# Altium project AUTetris.PrjPcb
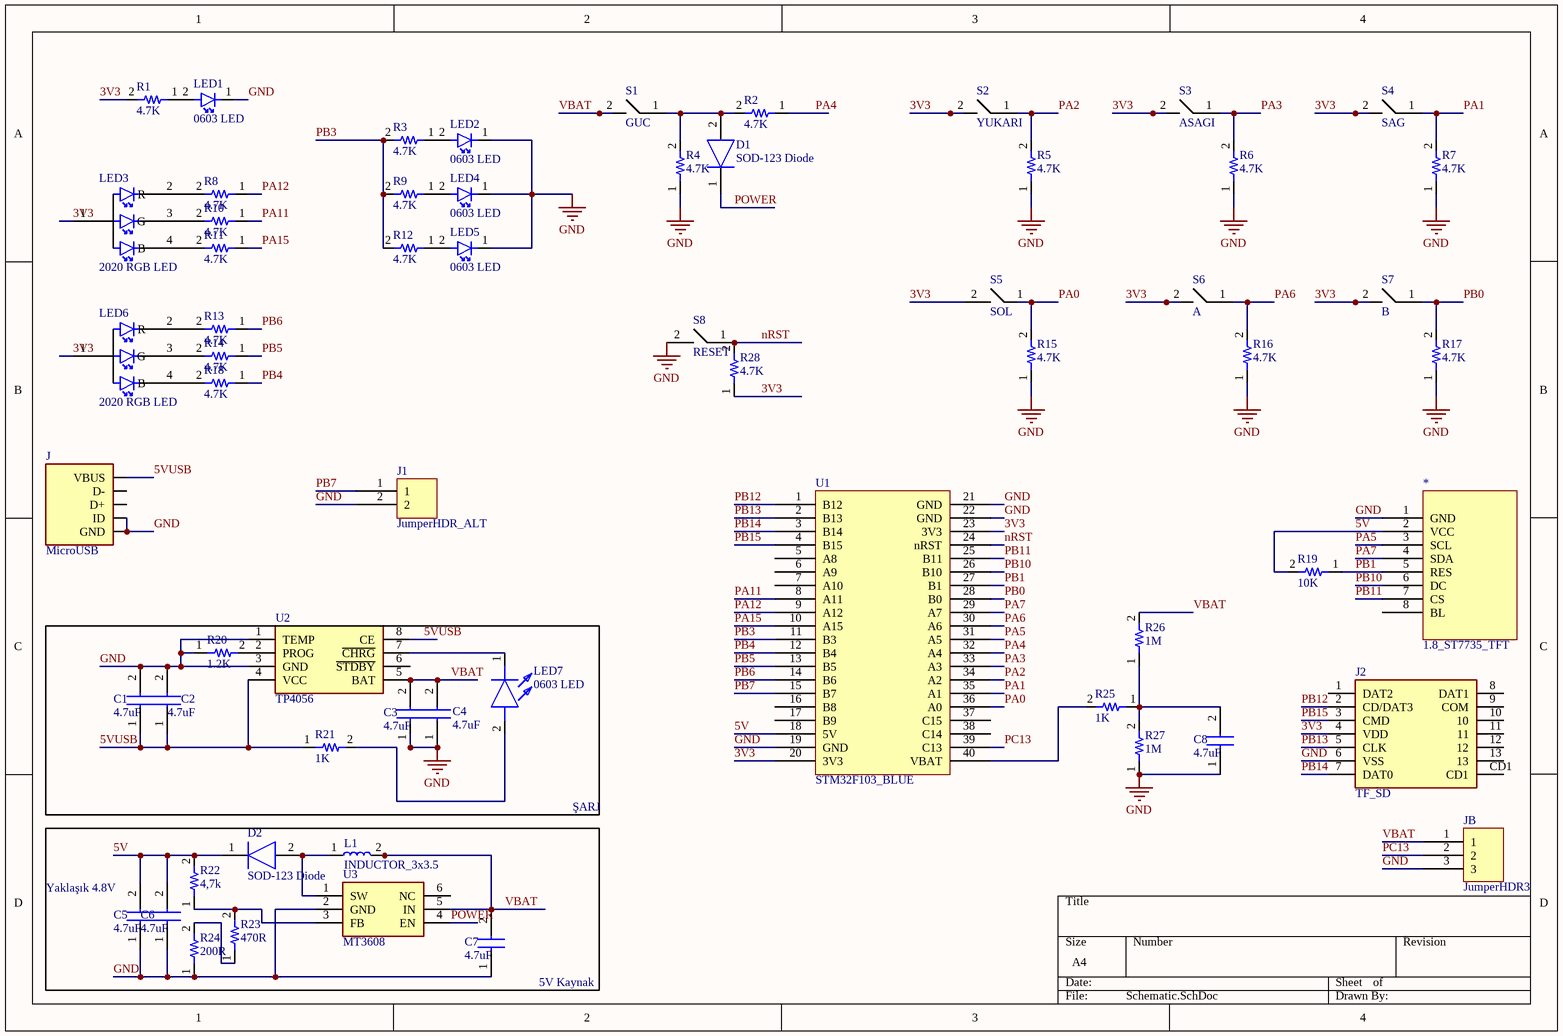
[diagram p0: Schematic.SchDoc]
1 sheet, 62 parts. Net scope: global (net labels, ports and power ports of the same name join across sheets).
Board file: PCB.PcbDoc

## Sheet Schematic.SchDoc
size A4; SheetNumber: 1; SheetTotal: 1

### Parts
*  1.8_ST7735_TFT  [1.8_ST7735_TFT]
C1  4.7uF  [0603 Capacitor]
C2  4.7uF  [0603 Capacitor]
C3  4.7uF  [0603 Capacitor]
C4  4.7uF  [0603 Capacitor]
C5  4.7uF  [0603 Capacitor]
C6  4.7uF  [0603 Capacitor]
C7  4.7uF  [0603 Capacitor]
C8  4.7uF  [0603 Capacitor]
D1  SOD-123 Diode  [SOD123]
D2  SOD-123 Diode  [SOD123]
J  MicroUSB  [MicroUSB]
J1  JumperHDR_ALT  [JumperHDR]
J2  TF_SD  [TF_SD]
JB  JumperHDR3  [JumperHDR3]
L1  INDUCTOR_3x3.5  [INDUCTOR_3x3.5]
LED1  0603 LED  [0603 LED]
LED2  0603 LED  [0603 LED]
LED3  2020 RGB LED  [20x20 RGB LED]
LED4  0603 LED  [0603 LED]
LED5  0603 LED  [0603 LED]
LED6  2020 RGB LED  [20x20 RGB LED]
LED7  0603 LED  [0603 LED]
R1  4.7K  [0603 Resistor]
R2  4.7K  [0603 Resistor]
R3  4.7K  [0603 Resistor]
R4  4.7K  [0603 Resistor]
R5  4.7K  [0603 Resistor]
R6  4.7K  [0603 Resistor]
R7  4.7K  [0603 Resistor]
R8  4.7K  [0603 Resistor]
R9  4.7K  [0603 Resistor]
R10  4.7K  [0603 Resistor]
R11  4.7K  [0603 Resistor]
R12  4.7K  [0603 Resistor]
R13  4.7K  [0603 Resistor]
R14  4.7K  [0603 Resistor]
R15  4.7K  [0603 Resistor]
R16  4.7K  [0603 Resistor]
R17  4.7K  [0603 Resistor]
R18  4.7K  [0603 Resistor]
R19  10K  [0603 Resistor]
R20  1.2K  [0603 Resistor]
R21  1K  [0603 Resistor]
R22  4,7k  [0603 Resistor]
R23  470R  [0603 Resistor]
R24  200R  [0603 Resistor]
R25  1K  [0603 Resistor]
R26  1M  [0603 Resistor]
R27  1M  [0603 Resistor]
R28  4.7K  [0603 Resistor]
S1  GUC  [TACT SWITCH SMD]
S2  YUKARI  [12x12 Tact Switch]
S3  ASAGI  [12x12 Tact Switch]
S4  SAG  [12x12 Tact Switch]
S5  SOL  [12x12 Tact Switch]
S6  A  [12x12 Tact Switch]
S7  B  [12x12 Tact Switch]
S8  RESET  [TACT SWITCH SMD]
U1  STM32F103_BLUE  [STM32_BLUE_PILL]
U2  TP4056  [TP4056A]
U3  MT3608  [MT3608]

### Blocks framed on the sheet
ŞARJ: C1-C4 LED7 R20 R21 U2

### Nets
GND: *.1(GND) C1.2 C2.2 C3.1 C4.1 C5.1 C6.1 C7.1 C8.1 J.4(ID) J.5(GND) J1.2 J2.6(VSS) JB.3 LED1.1(K) LED2.1(K) LED4.1(K) LED5.1(K) R4.1 R5.1 R6.1 R7.1 R15.1 R16.1 R17.1 R20.1 R24.1 R27.1 S8.2 U1.19(GND) U1.21(GND) U1.22(GND) U2.1(TEMP) U2.3(GND) U3.2(GND)
3V3: J2.4(VDD) LED3.1 LED6.1 R1.2 R28.1 S2.2 S3.2 S4.2 S5.2 S6.2 S7.2 U1.20(3V3) U1.23(3V3)
5V: *.2(VCC) C5.2 C6.2 D2.1(K) R19.2 R22.2 U1.18(5V)
5VUSB: C1.1 C2.1 J.1(VBUS) R21.1 U2.4(VCC) U2.8(CE)
nRST: R28.2 S8.1 U1.24(nRST)
PA0: R15.2 S5.1 U1.36(A0)
PA1: R7.2 S4.1 U1.35(A1)
PA2: R5.2 S2.1 U1.34(A2)
PA3: R6.2 S3.1 U1.33(A3)
PA4: R2.1 U1.32(A4)
PA5: *.3(SCL) U1.31(A5)
PA6: R16.2 S6.1 U1.30(A6)
PA7: *.4(SDA) U1.29(A7)
PA11: R10.1 U1.8(A11)
PA12: R8.1 U1.9(A12)
PA15: R11.1 U1.10(A15)
PB0: R17.2 S7.1 U1.28(B0)
PB1: *.5(RES) R19.1 U1.27(B1)
PB3: R3.2 R9.2 R12.2 U1.11(B3)
PB4: R18.1 U1.12(B4)
PB5: R14.1 U1.13(B5)
PB6: R13.1 U1.14(B6)
PB7: J1.1 U1.15(B7)
PB10: *.6(DC) U1.26(B10)
PB11: *.7(CS) U1.25(B11)
PB12: J2.2(CD/DAT3) U1.1(B12)
PB13: J2.5(CLK) U1.2(B13)
PB14: J2.7(DAT0) U1.3(B14)
PB15: J2.3(CMD) U1.4(B15)
PC13: JB.2 U1.39(C13)
POWER: D1.1(K) U3.4(EN)
VBAT: C3.2 C4.2 C7.2 JB.1 L1.2 R26.2 S1.2 U2.5(BAT) U3.5(IN)
NetC8_2: C8.2 R25.1 R26.1 R27.2
NetD1_2: D1.2(A) R2.2 R4.2 S1.1
NetD2_2: D2.2(A) L1.1 U3.1(SW)
NetLED1_2: LED1.2(A) R1.1
NetLED2_2: LED2.2(A) R3.1
NetLED3_2: LED3.2(R) R8.2
NetLED3_3: LED3.3(G) R10.2
NetLED3_4: LED3.4(B) R11.2
NetLED4_2: LED4.2(A) R9.1
NetLED5_2: LED5.2(A) R12.1
NetLED6_2: LED6.2(R) R13.2
NetLED6_3: LED6.3(G) R14.2
NetLED6_4: LED6.4(B) R18.2
NetLED7_1: LED7.1(K) U2.7(~{CHRG})
NetLED7_2: LED7.2(A) R21.2
NetR20_2: R20.2 U2.2(PROG)
NetR22_1: R22.1 R23.2 U3.3(FB)
NetR23_1: R23.1 R24.2
NetR25_2: R25.2 U1.40(VBAT)

Not connected (* = marked no-connect by the designer): * 8(BL); J 2(D-) 3(D+); J2 1(DAT2) 8(DAT1) 9(COM) 10 11 12 13 CD1; U1 5(A8) 6(A9) 7(A10) 16(B8) 17(B9) 37(C15) 38(C14); U2 6(~{STDBY}); U3 6(NC)

### Notes on the sheet
- (near C5) Yaklaşık 4.8V
- 5V Kaynak

### Library data of the parts
C1-C8 = 0603 Capacitor: Capacitor; Manufacturer_Name: AVX; Manufacturer_Part_Number: 06031A120JAT2A; Datasheet Link: http://www.mouser.com/catalog/supplier/library/pdf/AVXSurfaceMountCeramic.pdf; Height: 0.9mm; Mouser Part Number: 581-06031A120J; Mouser Price/Stock: https://www.mouser.co.uk/ProductDetail/AVX/06031A120JAT2A?qs=tMrmimOZp5UsY%252BxF6dNGxQ%3D%3D; Arrow Part Number: 06031A120JAT2A; Arrow Price/Stock: https://www.arrow.com/en/products/06031a120jat2a/avx
D1 D2 = SOD-123 Diode: Diode; Manufacturer_Name: Vishay; Manufacturer_Part_Number: 1N4148W-G3-08; Datasheet Link: https://componentsearchengine.com/Datasheets/1/1N4148W-G3-08.pdf; Height: 1.35mm; Mouser Part Number: 78-1N4148W-G3-08; Mouser Price/Stock: https://www.mouser.co.uk/ProductDetail/Vishay-Semiconductors/1N4148W-G3-08?qs=uS%252BVSIFnvp46StDBB15x4Q%3D%3D; Arrow Part Number: 1N4148W-G3-08; Arrow Price/Stock: https://www.arrow.com/en/products/1n4148w-g3-08/vishay
J = MicroUSB: MP: ZX62-B-5PA; MF: Hirose; Value: *; Price: None; SnapEDA_Link: https://www.snapeda.com/parts/ZX62-B-5PA/Hirose%20Electric%20Co%20Ltd/view-part/134668/?ref=snap; Availability: Unavailable; Package: None
J2 = TF_SD: Connector; Manufacturer_Name: AVX; Manufacturer_Part_Number: 045138008100858+; Datasheet Link: https://www.mouser.sg/datasheet/2/909/5138-1359342.pdf; Height: 1.4mm; Mouser Part Number: 581-045138008100858+; Mouser Price/Stock: https://www.mouser.com/Search/Refine.aspx?Keyword=581-045138008100858%2B; Arrow Part Number: 045138008100858+; Arrow Price/Stock: https://www.arrow.com/en/products/045138008100858/avx
L1 = INDUCTOR_3x3.5: Inductor; Manufacturer_Name: Shuo Xing; Manufacturer_Part_Number: CD32-4R7M; Datasheet Link: http://aitendo3.sakura.ne.jp/aitendo_data/product_img/parts/coil/CD32/CD32.pdf; Height: 2.4mm
LED1 LED2 LED4 LED5 LED7 = 0603 LED: LED; Manufacturer_Name: Wurth Elektronik; Manufacturer_Part_Number: 150060GS55040; Datasheet Link: https://katalog.we-online.de/led/datasheet/150060GS55040.pdf; Height: 0.5mm; Mouser Part Number: 710-150060GS55040; Mouser Price/Stock: https://www.mouser.com/Search/Refine.aspx?Keyword=710-150060GS55040
LED3 LED6 = 2020 RGB LED: LED; Manufacturer_Name: Foshan NationStar Optoelectronics; Manufacturer_Part_Number: FM-B2020RGBA-HG; Datasheet Link: https://datasheet.lcsc.com/szlcsc/Foshan-NationStar-Optoelectronics-FM-B2020RGBA-HG_C108793.pdf; Height: 1.1mm
R1-R28 = 0603 Resistor: Resistor; Manufacturer_Name: TE Connectivity; Manufacturer_Part_Number: CPF0603B100RE1; Datasheet Link: http://www.farnell.com/datasheets/1786775.pdf; Height: 0.55mm; Mouser Part Number: 279-CPF0603B100RE1; Mouser Price/Stock: https://www.mouser.co.uk/ProductDetail/TE-Connectivity-Neohm/CPF0603B100RE1?qs=DfH2yQaBz6s2KWheq2AlNw%3D%3D; Arrow Part Number: CPF0603B100RE1; Arrow Price/Stock: https://www.arrow.com/en/products/cpf0603b100re1/te-connectivity
S1 S8 = TACT SWITCH SMD: MP: B3F-1000; MF: Omron; Price: None; Package: None; Value: *; Availability: Unavailable; SnapEDA_Link: https://www.snapeda.com/parts/B3F-1000/Omron%20Electronics%20Inc-EMC%20Div/view-part/48569/?ref=snap
S2-S7 = TACTSWITCH_12x12: Switch; Manufacturer_Name: Omron Electronics; Manufacturer_Part_Number: B3F-4005; Datasheet Link: http://omronfs.omron.com/en_US/ecb/products/pdf/en-b3f.pdf; Mouser Part Number: 653-B3F-4005; Mouser Price/Stock: https://www.mouser.co.uk/ProductDetail/Omron-Electronics/B3F-4005?qs=B3tblJ0Nlt%2F4UotbOU6yJQ%3D%3D; Arrow Part Number: B3F-4005; Arrow Price/Stock: https://www.arrow.com/en/products/b3f4005/omron?region=nac
U2 = TP4056: Connector; Manufacturer_Name: NanJing Top Power; Datasheet Link: https://dlnmh9ip6v2uc.cloudfront.net/datasheets/Prototyping/TP4056.pdf; Height: 1.75mm; Manufacturer_Part_Number: TP4056
U3 = MT3608: Undefined or Miscellaneous; Manufacturer_Name: Aerosemi; Datasheet Link: https://www.olimex.com/Products/Breadboarding/BB-PWR-3608/resources/MT3608.pdf; Height: 1.45mm; Manufacturer_Part_Number: MT3608